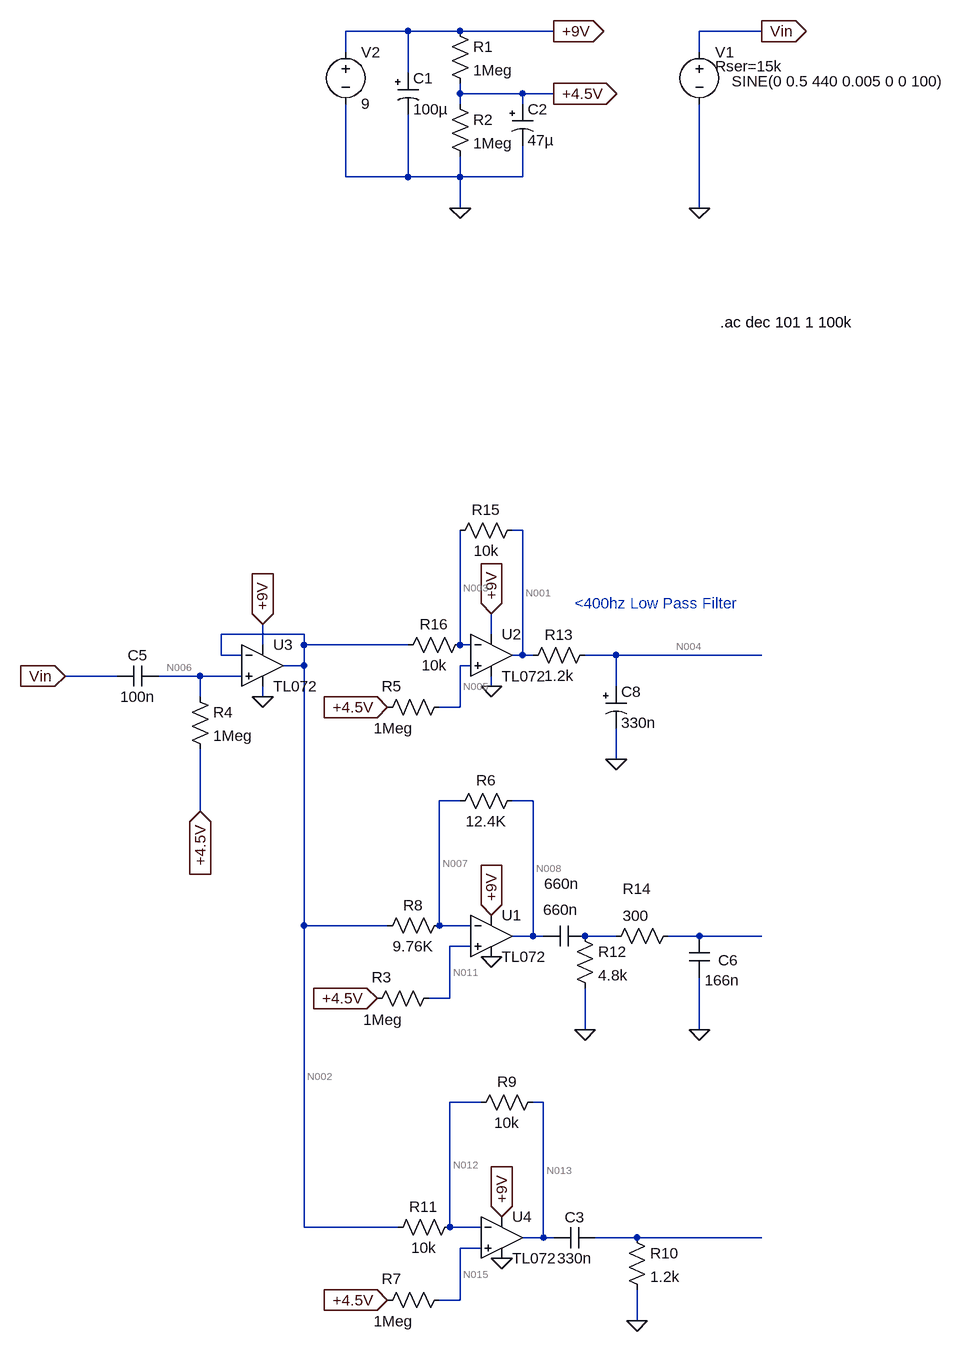
[diagram p0: schematic noise-gate-2.asc]
noise-gate-2.asc, the LTspice schematic file:
Version 4
SHEET 1 1364 2268
WIRE 0 192 -96 192
WIRE 80 192 0 192
WIRE 224 192 80 192
WIRE 544 192 448 192
WIRE -96 224 -96 192
WIRE 448 224 448 192
WIRE 0 256 0 192
WIRE 80 288 80 272
WIRE 176 288 80 288
WIRE 224 288 176 288
WIRE 80 304 80 288
WIRE 176 304 176 288
WIRE -96 416 -96 304
WIRE 0 416 0 320
WIRE 0 416 -96 416
WIRE 80 416 80 384
WIRE 80 416 0 416
WIRE 176 416 176 368
WIRE 176 416 80 416
WIRE 80 464 80 416
WIRE 448 464 448 304
WIRE 176 960 160 960
WIRE -160 1120 -288 1120
WIRE 128 1120 128 1088
WIRE -224 1136 -224 1104
WIRE -160 1136 -160 1120
WIRE 0 1136 -160 1136
WIRE 80 1136 80 960
WIRE 96 1136 80 1136
WIRE -288 1152 -288 1120
WIRE -256 1152 -288 1152
WIRE 176 1152 176 960
WIRE 176 1152 160 1152
WIRE 192 1152 176 1152
WIRE 320 1152 272 1152
WIRE 544 1152 320 1152
WIRE -160 1168 -160 1136
WIRE -160 1168 -192 1168
WIRE 96 1168 80 1168
WIRE -448 1184 -528 1184
WIRE -320 1184 -384 1184
WIRE -256 1184 -320 1184
WIRE 128 1200 128 1184
WIRE 320 1200 320 1152
WIRE -320 1216 -320 1184
WIRE -224 1216 -224 1200
WIRE 80 1232 80 1168
WIRE 80 1232 48 1232
WIRE 320 1312 320 1264
WIRE 80 1376 48 1376
WIRE 192 1376 160 1376
WIRE -320 1392 -320 1296
WIRE -160 1568 -160 1168
WIRE -32 1568 -160 1568
WIRE 48 1568 48 1376
WIRE 96 1568 48 1568
WIRE 192 1584 192 1376
WIRE 192 1584 160 1584
WIRE 208 1584 192 1584
WIRE 320 1584 272 1584
WIRE 448 1584 400 1584
WIRE 544 1584 448 1584
WIRE 96 1600 64 1600
WIRE 64 1680 64 1600
WIRE 64 1680 32 1680
WIRE 272 1728 272 1664
WIRE 448 1728 448 1648
WIRE 112 1840 64 1840
WIRE 208 1840 192 1840
WIRE -160 2032 -160 1568
WIRE -16 2032 -160 2032
WIRE 64 2032 64 1840
WIRE 112 2032 64 2032
WIRE 208 2048 208 1840
WIRE 208 2048 176 2048
WIRE 224 2048 208 2048
WIRE 352 2048 288 2048
WIRE 544 2048 352 2048
WIRE 112 2064 80 2064
WIRE 80 2144 80 2064
WIRE 80 2144 48 2144
WIRE 352 2176 352 2128
FLAG 448 464 0
FLAG 80 464 0
FLAG 224 288 +4.5V
IOPIN 224 288 Out
FLAG 544 192 Vin
IOPIN 544 192 Out
FLAG 224 192 +9V
IOPIN 224 192 Out
FLAG 128 1200 0
FLAG 128 1088 +9V
IOPIN 128 1088 In
FLAG -32 1232 +4.5V
IOPIN -32 1232 In
FLAG 128 1616 0
FLAG 128 1552 +9V
IOPIN 128 1552 In
FLAG 320 1312 0
FLAG -48 1680 +4.5V
IOPIN -48 1680 In
FLAG -224 1216 0
FLAG -224 1104 +9V
IOPIN -224 1104 In
FLAG -320 1392 +4.5V
IOPIN -320 1392 In
FLAG -528 1184 Vin
IOPIN -528 1184 In
FLAG 144 2080 0
FLAG 144 2016 +9V
IOPIN 144 2016 In
FLAG -32 2144 +4.5V
IOPIN -32 2144 In
FLAG 352 2176 0
FLAG 272 1728 0
FLAG 448 1728 0
SYMBOL voltage 448 208 R0
WINDOW 3 50 61 Left 2
WINDOW 39 24 38 Left 2
SYMATTR Value SINE(0 0.5 440 0.005 0 0 100)
SYMATTR SpiceLine Rser=15k
SYMATTR InstName V1
SYMATTR Value2 AC 0.5
SYMBOL voltage -96 208 R0
SYMATTR InstName V2
SYMATTR Value 9
SYMBOL res 64 176 R0
SYMATTR InstName R1
SYMATTR Value 1Meg
SYMBOL res 64 288 R0
SYMATTR InstName R2
SYMATTR Value 1Meg
SYMBOL polcap -16 256 R0
SYMATTR InstName C1
SYMATTR Value 100µ
SYMBOL polcap 160 304 R0
SYMATTR InstName C2
SYMATTR Value 47µ
SYMBOL res 64 1216 R90
WINDOW 0 -1 89 VBottom 2
WINDOW 3 33 87 VTop 2
SYMATTR InstName R5
SYMATTR Value 1Meg
SYMBOL OpAmps/TL072 128 1088 R0
SYMATTR InstName U2
SYMBOL OpAmps/TL072 128 1520 R0
SYMATTR InstName U1
SYMBOL res 288 1136 R90
WINDOW 0 0 56 VBottom 2
WINDOW 3 32 56 VTop 2
SYMATTR InstName R13
SYMATTR Value 1.2k
SYMBOL res 48 1664 R90
WINDOW 0 -1 89 VBottom 2
WINDOW 3 33 87 VTop 2
SYMATTR InstName R3
SYMATTR Value 1Meg
SYMBOL OpAmps/TL072 -224 1104 R0
SYMATTR InstName U3
SYMBOL res -336 1200 R0
SYMATTR InstName R4
SYMATTR Value 1Meg
SYMBOL cap -384 1168 R90
WINDOW 0 0 32 VBottom 2
WINDOW 3 32 32 VTop 2
SYMATTR InstName C5
SYMATTR Value 100n
SYMBOL polcap 304 1200 R0
SYMATTR InstName C8
SYMATTR Value 330n
SYMBOL OpAmps/TL072 144 1984 R0
SYMATTR InstName U4
SYMBOL res 64 2128 R90
WINDOW 0 -1 89 VBottom 2
WINDOW 3 33 87 VTop 2
SYMATTR InstName R7
SYMATTR Value 1Meg
SYMBOL res 96 1856 R270
WINDOW 0 32 56 VTop 2
WINDOW 3 0 56 VBottom 2
SYMATTR InstName R9
SYMATTR Value 10k
SYMBOL res -32 2048 R270
WINDOW 0 32 56 VTop 2
WINDOW 3 0 56 VBottom 2
SYMATTR InstName R11
SYMATTR Value 10k
SYMBOL cap 224 2064 R270
WINDOW 0 32 32 VTop 2
WINDOW 3 0 32 VBottom 2
SYMATTR InstName C3
SYMATTR Value 330n
SYMBOL res 336 2032 R0
SYMATTR InstName R10
SYMATTR Value 1.2k
SYMBOL cap 272 1568 R90
WINDOW 0 -49 36 VBottom 2
WINDOW 3 -40 37 VTop 2
SYMATTR InstName 660n
SYMATTR Value 660n
SYMBOL res 256 1568 R0
SYMATTR InstName R12
SYMATTR Value 4.8k
SYMBOL res 304 1600 R270
WINDOW 0 73 48 VTop 2
WINDOW 3 63 46 VBottom 2
SYMATTR InstName R14
SYMATTR Value 300
SYMBOL cap 464 1648 R180
WINDOW 0 -44 27 Left 2
WINDOW 3 -46 -4 Left 2
SYMATTR InstName C6
SYMATTR Value 166n
SYMBOL res 64 1392 R270
WINDOW 0 32 56 VTop 2
WINDOW 3 0 56 VBottom 2
SYMATTR InstName R6
SYMATTR Value 12.4K
SYMBOL res -48 1584 R270
WINDOW 0 32 56 VTop 2
WINDOW 3 0 56 VBottom 2
SYMATTR InstName R8
SYMATTR Value 9.76K
SYMBOL res 64 976 R270
WINDOW 0 32 56 VTop 2
WINDOW 3 0 56 VBottom 2
SYMATTR InstName R15
SYMATTR Value 10k
SYMBOL res -16 1152 R270
WINDOW 0 32 56 VTop 2
WINDOW 3 0 56 VBottom 2
SYMATTR InstName R16
SYMATTR Value 10k
TEXT 480 640 Left 2 !.ac dec 101 1 100k
TEXT 256 1072 Left 2 ;<400hz Low Pass Filter

The netlist it stands for:
* noise-gate-2.asc
V1 Vin 0 SINE(0 0.5 440 0.005 0 0 100) AC 0.5 Rser=15k
V2 +9V 0 9
R1 +9V +4.5V 1Meg
R2 +4.5V 0 1Meg
C1 +9V 0 100µ
C2 +4.5V 0 47µ
R5 N005 +4.5V 1Meg
XU2 N005 N003 +9V 0 N001 TL072  ; pins In+ In- V+ V- OUT
XU1 N011 N007 +9V 0 N008 TL072  ; pins In+ In- V+ V- OUT
R13 N004 N001 1.2k
R3 N011 +4.5V 1Meg
XU3 N006 N002 +9V 0 N002 TL072  ; pins In+ In- V+ V- OUT
R4 N006 +4.5V 1Meg
C5 N006 Vin 100n
C8 N004 0 330n
XU4 N015 N012 +9V 0 N013 TL072  ; pins In+ In- V+ V- OUT
R7 N015 +4.5V 1Meg
R9 N012 N013 10k
R11 N002 N012 10k
C3 N013 N014 330n
R10 N014 0 1.2k
C§660n N009 N008 660n
R12 N009 0 4.8k
R14 N009 N010 300
C6 0 N010 166n
R6 N007 N008 12.4K
R8 N002 N007 9.76K
R15 N003 N001 10k
R16 N002 N003 10k
.ac dec 101 1 100k
* <400hz Low Pass Filter
.backanno
.end

* Results of the author's LTspice run, read from the files saved beside the schematic
* Operating Point, zero values left out:
*   V(+9v) = 9 V
*   V(+4.5v) = 4.5 V
*   V(n005) = 4.5 V
*   V(n001) = 4.5 V
*   V(n003) = 4.5 V
*   V(n008) = 4.5 V
*   V(n007) = 4.5 V
*   V(n011) = 4.5 V
*   V(n004) = 4.5 V
*   V(n002) = 4.5 V
*   V(n006) = 4.5 V
*   V(n013) = 4.5 V
*   V(n012) = 4.5 V
*   V(n015) = 4.5 V
*   I(R15) = -34.55 pA
*   I(R6) = -34.55 pA
*   I(R9) = -34.55 pA
*   I(R7) = -34.55 pA
*   I(R4) = -34.55 pA
*   I(R3) = -34.55 pA
*   I(R5) = -34.55 pA
*   I(R2) = 4.5 µA
*   I(R1) = 4.5 µA
*   I(V2) = -17.58 mA
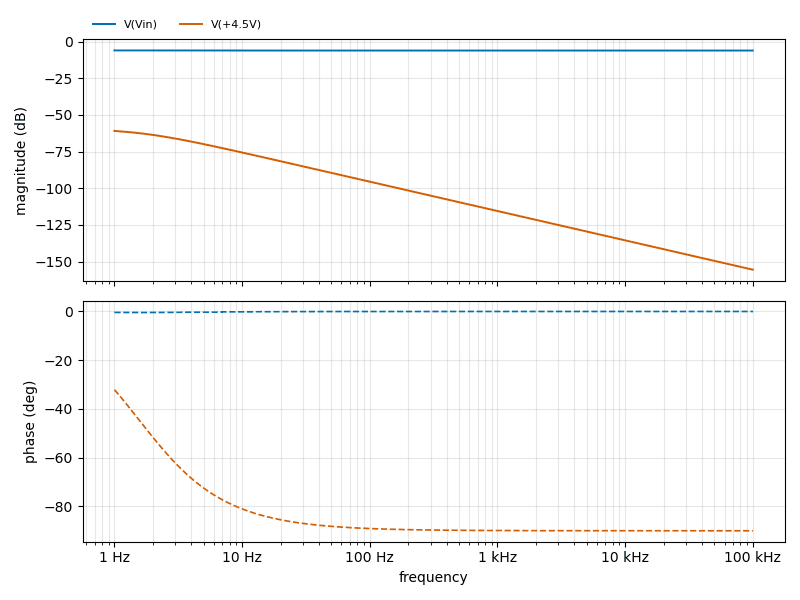
[diagram p1: AC Analysis of noise-gate-2.asc, plotted from the saved traces]
* AC Analysis, 1 run:
*   V(Vin): -6.06 dB at 1 Hz, -6.15 dB at 100 kHz, peak -6.06 dB at 1 Hz
*   V(+4.5V): -60.96 dB at 1 Hz, -155.56 dB at 100 kHz, peak -60.96 dB at 1 Hz, 3 dB below the peak at 2.114 Hz